# Altium schematic sheet VOLT_REGULATION.SchDoc
size B
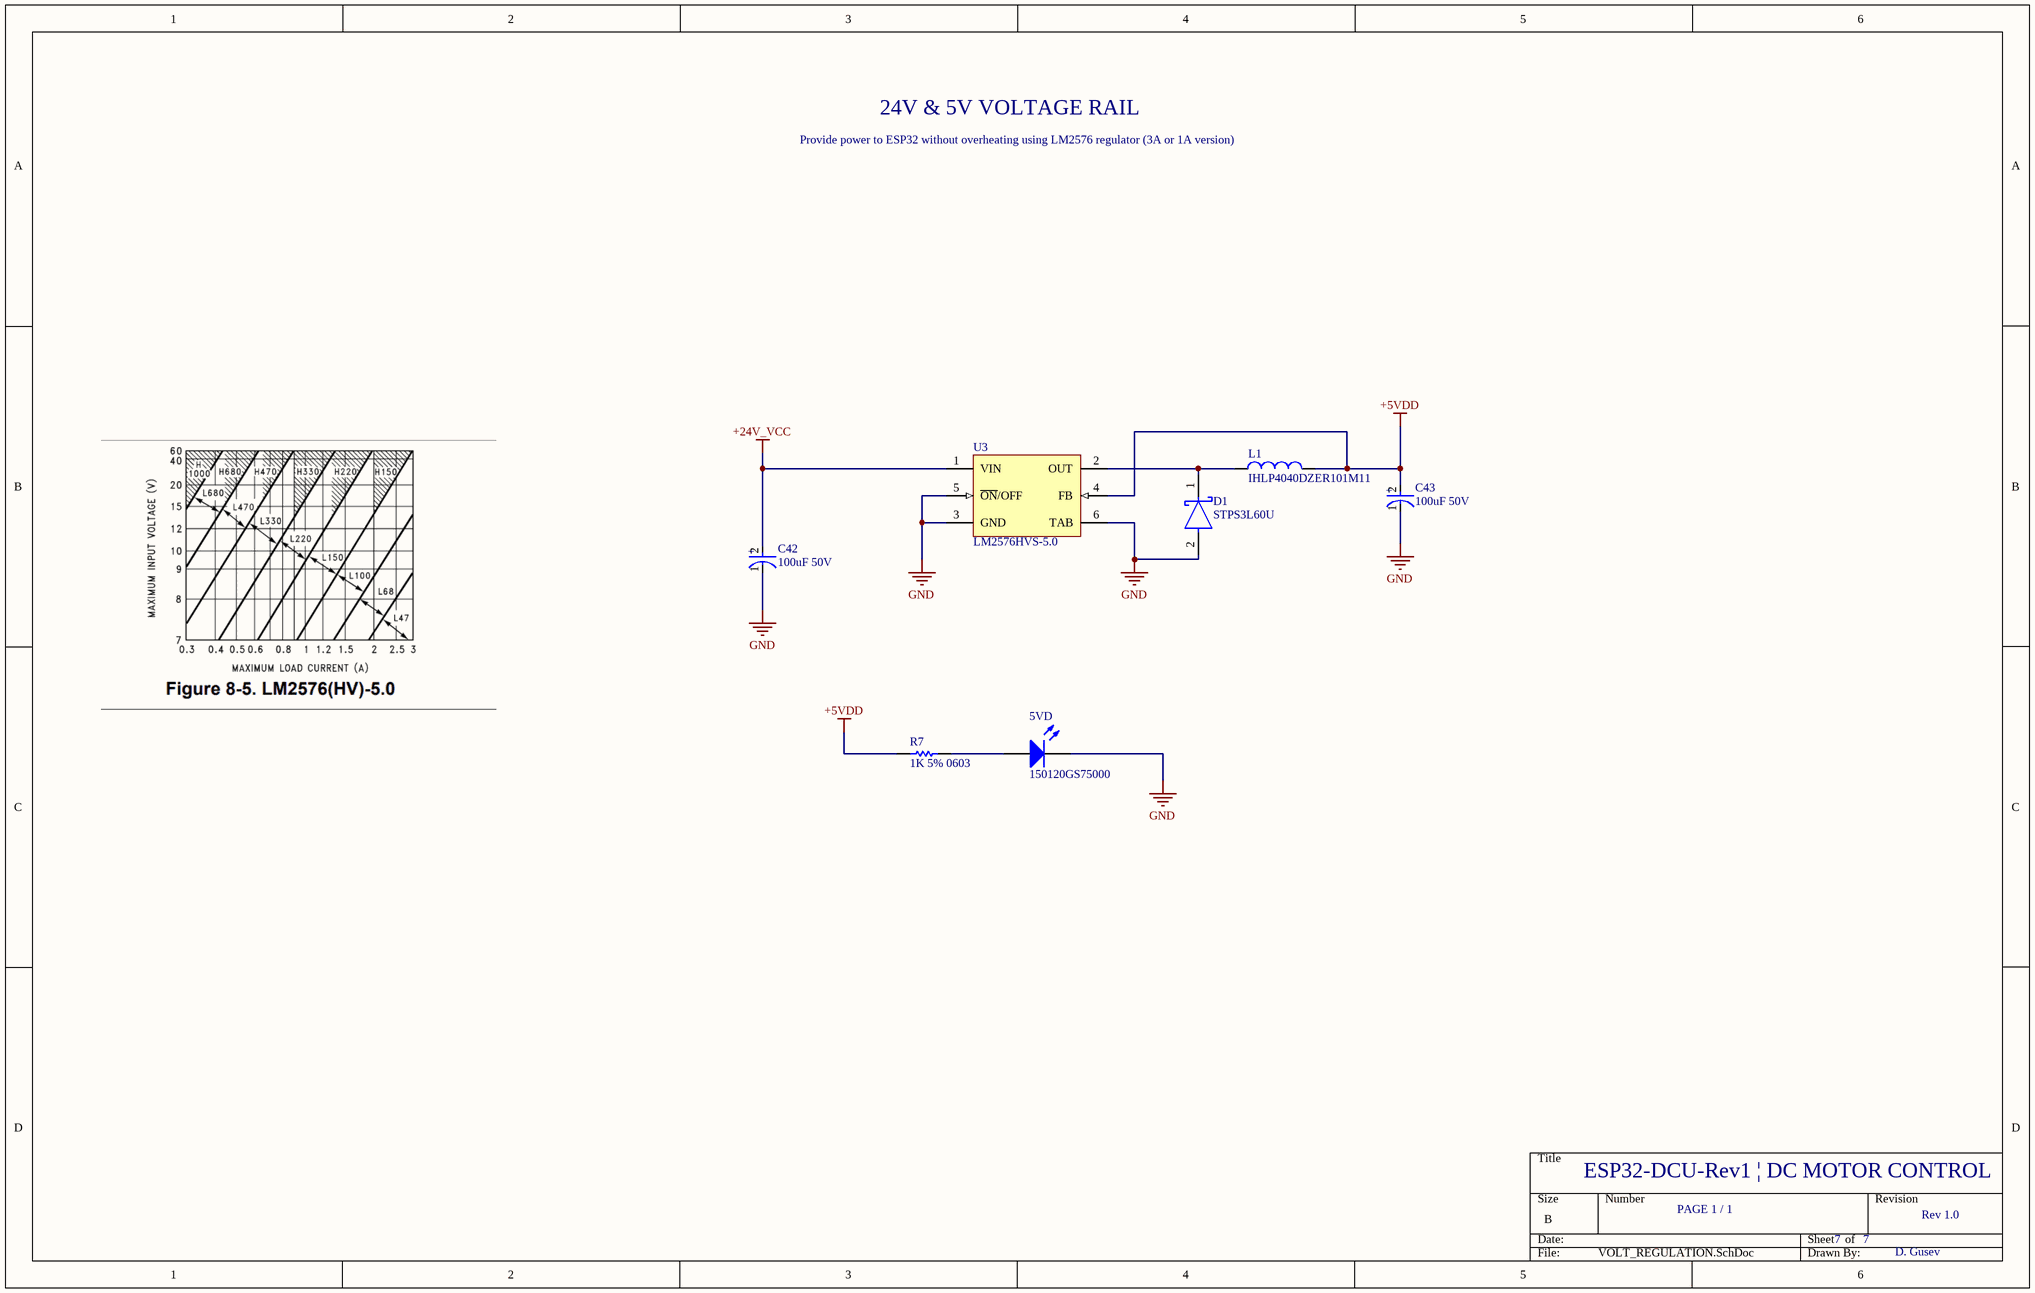
[diagram p0: VOLT_REGULATION.SchDoc]

## Parts
5VD  150120GS75000  [1206_A]
C42  100uF 50V  [FP-EEE-FK1H101P-MFG]
C43  100uF 50V  [FP-EEE-FK1H101P-MFG]
D1  STPS3L60U  [FP-SMB-MFG]
L1  IHLP4040DZER101M11  [VISH-IHLP4040DZER101M11_V]
R7  1K 5% 0603  [RESC1608X55X25NL10T15]
U3  LM2576HVS-5.0  [KTT0005B_L]

## Nets
+5VDD: C43.2(A) L1.2 R7.1 U3.4(FB)
+24V_VCC: C42.2(A) U3.1(VIN)
GND: 5VD.1(K) C42.1(C) C43.1(C) D1.2(A) U3.3(GND) U3.5(~{ON}/OFF) U3.6(TAB)
Net5VD_2: 5VD.2(A) R7.2
NetD1_1: D1.1(K) L1.1 U3.2(OUT)

## Notes on the sheet
- Provide power to ESP32 without overheating using LM2576 regulator (3A or 1A version)
- 24V & 5V VOLTAGE RAIL
- ESP32-DCU-Rev1 | DC MOTOR CONTROL
- PAGE 1 / 1
- 7
- Rev 1.0
- D. Gusev
- (in symbol CMP-2000-06208-2) +

## Library data of the parts
5VD = CMP-1426-00014-1: SMD mono-color Chip LED, WL-SMCW, Green; Manufacturer: Wuerth Elektronik; PackageReference: 1206_A; PartNumber: 150120GS75000; ComponentLink1Description: Manufacturer URL; ComponentLink2URL: http://katalog.we-online.com/led/datasheet/150120GS75000.pdf; ComponentLink2Description: Datasheet; Color: Green; ComponentLink1URL: http://www.we-online.com
C42 C43 = CMP-2000-06208-2: CAP ALUM 100UF 20% 50V SMD; Manufacturer Part Number: EEE-FK1H101P; Manufacturer: Panasonic Electronic Components; Automotive Grade: Grade 2; Dissipation Factor: 10%; Life: 2000Hours; Ripple Current: 350mA; Material: Aluminum; Esr: 0.34Ω; Leakage Current: 50uA; Tolerance: 20%; Package: 0; ComponentLink2URL: https://industrial.panasonic.com/cdbs/www-data/pdf/RDE0000/ABA0000C1181.pdf; Temperature Range Low: -55°C; Voltage Rating: 50V; ComponentLink2Description: Datasheet; Category: Cap; Digikey Description: CAP ALUM 100UF 20% 50V SMD; Octopart: https://octopart.com/eeefk1h101p-panasonic-4642841; Automotive: Yes; Temperature: -55°C to +105°C; Capacitance: 100uF; Lead Free: Yes; Mouser Description: Cap Aluminum Lytic 100uF 50V 20% (8 X 10.2mm) SMD 350mA 2000h 105C Automotive T/R; Height: 10.5mm; Device Class L3: Aluminum Electrolytic Capacitors; Value: 100uF; Device Class L1: Passive Components; RoHS: TRUE; Device Class L2: Capacitors; Temperature Range High: +105°C
D1 = CMP-12187-000023-1: DIODE SCHOTTKY 60V 3A SMB; Manufacturer: STMicroelectronics; Standoff Height: 0.05mm; Peak Reverse Current: 150uA; Max Junction Temp: +150°C; Max Surge Forward Current: 100A; Octopart: https://octopart.com/stps3l60u-stmicroelectronics-334329; Category: Diode; Height: 2.65mm; RoHS: TRUE; Mouser Description: Schottky diode Configuration: Single Housing type: DO-214AA=SMB Peak conducting-state current: 100 A; Forward Current: 3A; Manufacturer Part Number: STPS3L60U; Temperature: to +150°C; ComponentLink2URL: https://www.st.com/resource/en/datasheet/stps3l60.pdf; Max Repetitive Reverse Voltage: 60V; Device Class L1: Discrete Semiconductors; Automotive: No; Device Class L3: Schottky Diodes; Digikey Description: DIODE SCHOTTKY 60V 3A SMB; Lead Free: Yes; Temperature Range High: +150°C; Package: SMB; ComponentLink2Description: Datasheet; Device Class L2: Diodes
L1 = CMP-2000-06447-1: Low Profile, High Current IHLP(R) Inductor, 100 uH, +/- 20%, 2.5 A, -55 to 125 degC, 2-Pin SMD, RoHS, Tape and Reel; Manufacturer: Vishay; Qualification: AEC-Q200; Test Frequency: 100kHz; Maximum DC Resistance: 270mOhms; Type: LowProfileHighCurrentIHLPInductor; Inductance: 100uH; Unit Weight: 0.070548oz; Shielding: Shielded; Brand: Vishay/Dale; Maximum DC Current: 2.25A; Termination Style: SMD/SMT; Mounting Style: SMD/SMT; Tolerance: 20%; Factory Pack Quantity: 500; Product Category: FixedInductors; Mounting Technology: SurfaceMount; Manufacturer URL: http://www.vishay.com/; Operating Temperature Range: -55Cto+125C; Datasheet Version: 08/2015; Product: PowerInductors; Packaging: Reel; Length: 10.3mm; Package Description: 2-Pin Surface Mount Device, Body 10.3 x 10.3 mm; Height: 4mm; Width: 10.3mm; Series: IHLP-4040DZ-11; RoHS: True; Package Reference: IHLP4040DZER101M11; Tradename: IHLP; Datasheet URL: http://www.vishay.com/docs/34192/lp40dz11.pdf; Package / Case: 4040
R7 = CMP-1659-00009-4: Chip Resistor, 1 KOhm, +/-1%, 0.1 W, -55 to 155 degC, 0603 (1608 Metric), RoHS, Tape and Reel; Manufacturer: Yageo; Voltage Rating: 50 V; ComponentLink2URL: http://www.yageo.com/documents/recent/PYu-RC_Group_51_RoHS_L_04.pdf; Max Operating Temperature: 155 degC; PackageDescription: 2-Pin Surface Mount Device, Body 1.6 x 0.8 mm; Packaging: Tape and Reel; ComponentLink3Description: Package Specification; REACH SVHC: No SVHC; Mount: Surface Mount; ComponentLink2Description: Datasheet; Length: 1.6 mm; PackageReference: 0603; Height: 0.45 mm; DatasheetVersion: Rev. 4, 02/2016; Min Operating Temperature: -55 degC; ComponentLink1Description: Manufacturer URL; Package Quantity: 200; RoHSCompliant: true; ComponentLink3URL: http://www.farnell.com/datasheets/443971.pdf; Pins: 2; Mounting Technology: Surface Mount; ComponentLink1URL: http://www.yageo.com/
U3 = CMP-0069-00141-3: SIMPLE SWITCHER® 3A Step-Down Voltage Regulator, 5-pin TO-263; Manufacturer: Texas Instruments; PackageTopMarking: NSUZXYTTE#*LM2576*HVS-5.0 P+; PowerWise: N; RoHS: N; PackageDescription: TO-263, Molded, .400 x .390 x .180in, 5 Lead, .067in Pitch, Surface Mount; Code_JEDEC: MO-169-AB; CompType: Switcher; ComponentLink1URL: http://www.ti.com/general/docs/lit/getliterature.tsp?genericPartNumber=LM2576HV&fileType=pdf; ComponentLink1Description: Datasheet URL; PinCount: 5; PackageReference: KTT0005B